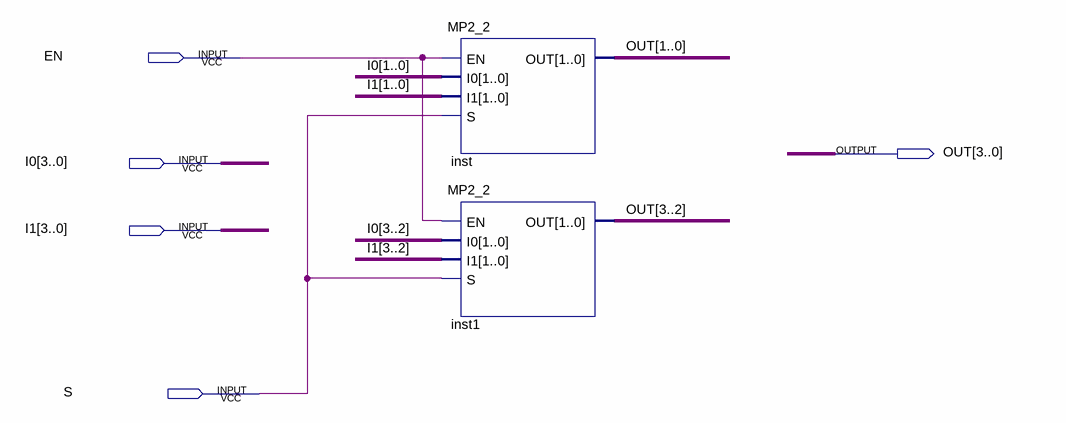
[diagram p0: schematic sheet]
// Quartus schematic MP2_4.bdf as structural Verilog: 2 symbols, 5 pins
module MP2_4 (
  input  EN,
  input  [3:0] I0,
  input  [3:0] I1,
  input  S,
  output [3:0] OUT
);

  MP2_2 inst (.EN(EN), .I0(I0[1:0]), .I1(I1[1:0]), .S(S), .OUT(OUT[1:0]));
  MP2_2 inst1 (.EN(EN), .I0(I0[3:2]), .I1(I1[3:2]), .S(S), .OUT(OUT[3:2]));
endmodule
